# Altium schematic sheet [01] - COVER PAGE.SchDoc
size A3; DocumentNumber: 1; SheetNumber: 1; SheetTotal: 6
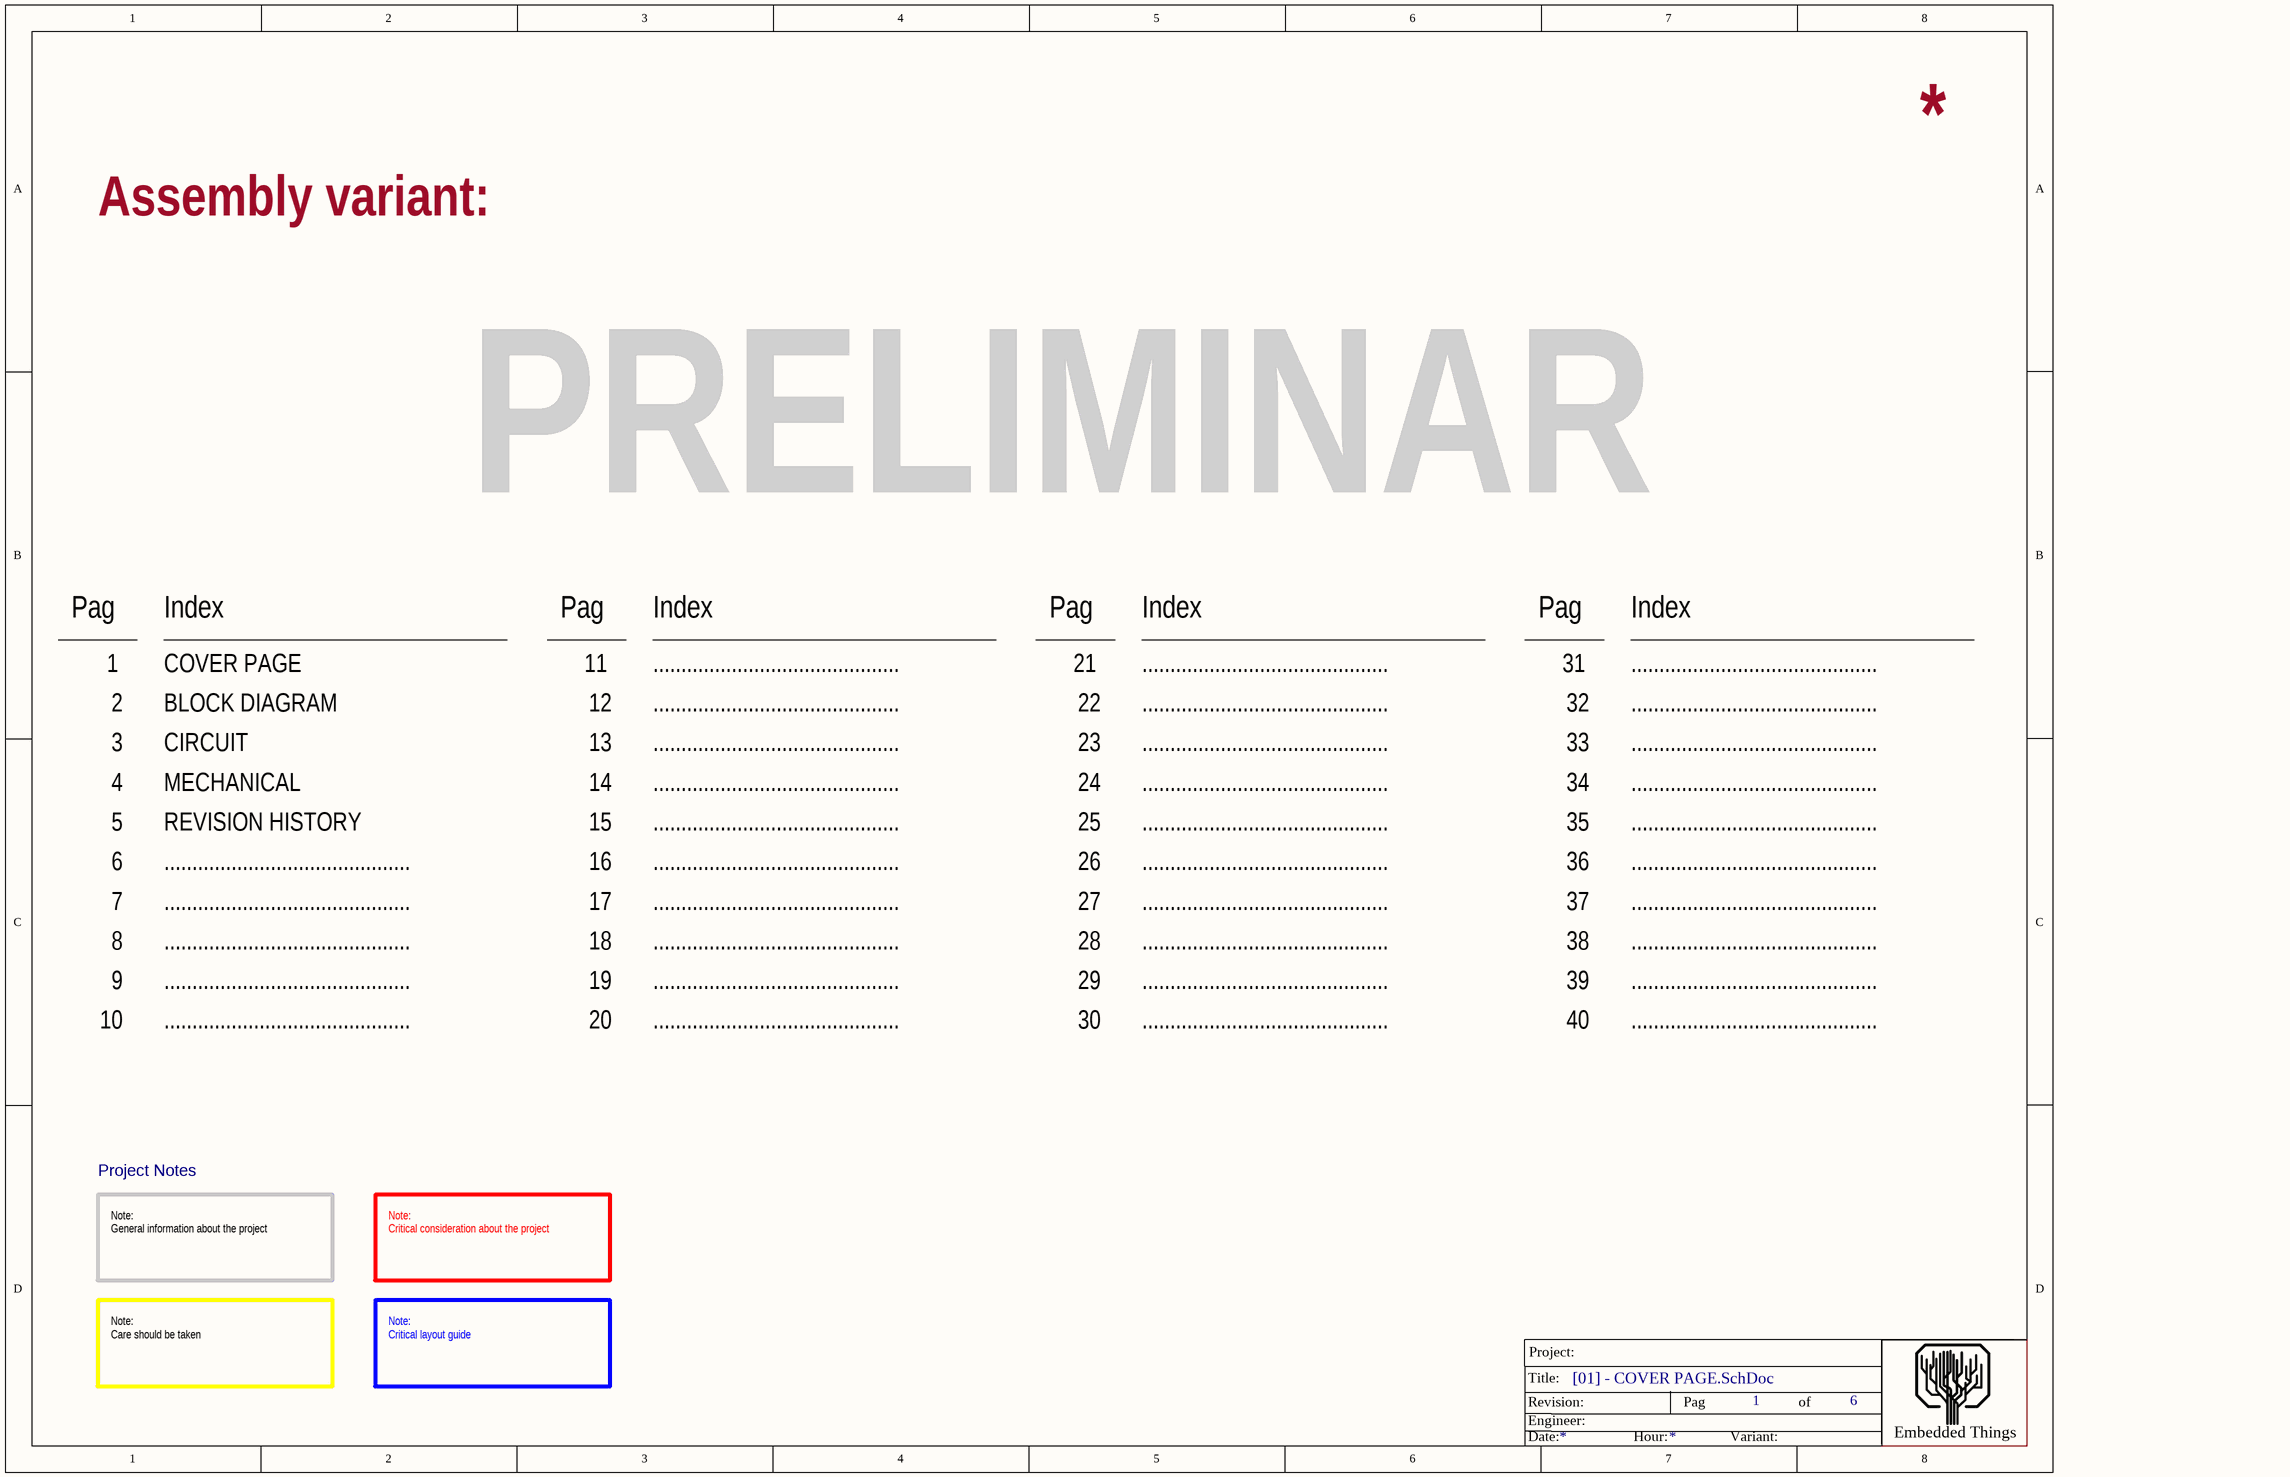
[diagram p0: [01] - COVER PAGE.SchDoc]

## Notes on the sheet
- Assembly variant:
- PRELIMINAR
- Pag
- Index
- 1
- COVER PAGE
- 11
- ............................................
- 21
- 31
- 2
- 3
- BLOCK DIAGRAM
- CIRCUIT
- 12
- 13
- 22
- 23
- 32
- 33
- 4
- 5
- MECHANICAL
- REVISION HISTORY
- 14
- 15
- 24
- 25
- 34
- 35
- 6
- 16
- 26
- 36
- 7
- 8
- 17
- 18
- 27
- 28
- 37
- 38
- 9
- 10
- 19
- 20
- 29
- 30
- 39
- 40
- Project Notes
- Note:
  General information about the project
- Note:
  Critical consideration about the project
- Note:
  Care should be taken
- Note:
  Critical layout guide
- Project:
- Revision:
- Engineer:
- Title:
- of
- Date:
- Hour:
- Variant:
- Embedded Things